# EAGLE design supply5v (EAGLE 7.7.0)
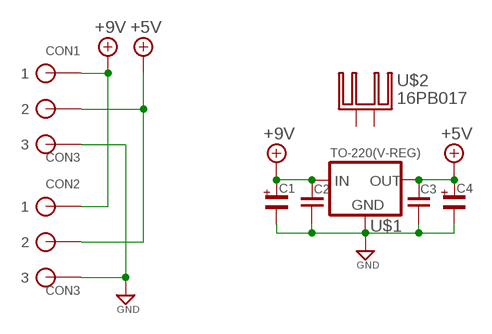
[diagram p0: schematic, sheet 1]

## Parts
C1  コンデンサ(電解)E2.5-5  [D=1,φ=5]
C2  (コンデンサ)セラミック050-024X044  [C050-024X044]
C3  (コンデンサ)セラミック050-024X044  [C050-024X044]
C4  コンデンサ(電解)E2.5-5  [D=1,φ=5]
CON1  CON3  [CON3]
CON2  CON3  [CON3]
U$1  TO-220(V-REG)  [TO-220]
U$2  16PB017  [16PB017]

## Nets
+5V: C3.1 C4.+ CON1.P$2 CON2.P$2 U$1.3(OUT)
+9V: C1.+ C2.1 CON1.P$1 CON2.P$1 U$1.2(IN)
GND: C1.- C2.2 C3.2 C4.- CON1.P$3 CON2.P$3 U$1.1(GND)
Unconnected: U$2.P$1(K) U$2.P$2(K)

## Library data of the parts
C1 C4 = (Foundation)電解コンデンサ:コンデンサ(電解): POLARIZED CAPACITOR, European symbol
C2 C3 = (Foundation)セラミックコンデンサ:(コンデンサ)セラミック: CAPACITOR, European symbol
CON1 CON2 = (コネクタ)XH:CON3: low insertion CON
U$1 = (半導体)FET＆トランジスタ:TO-220(V-REG)
U$2 = _Heatsink(ﾋｰﾄｼﾝｸ秋月):16PB017

## Board
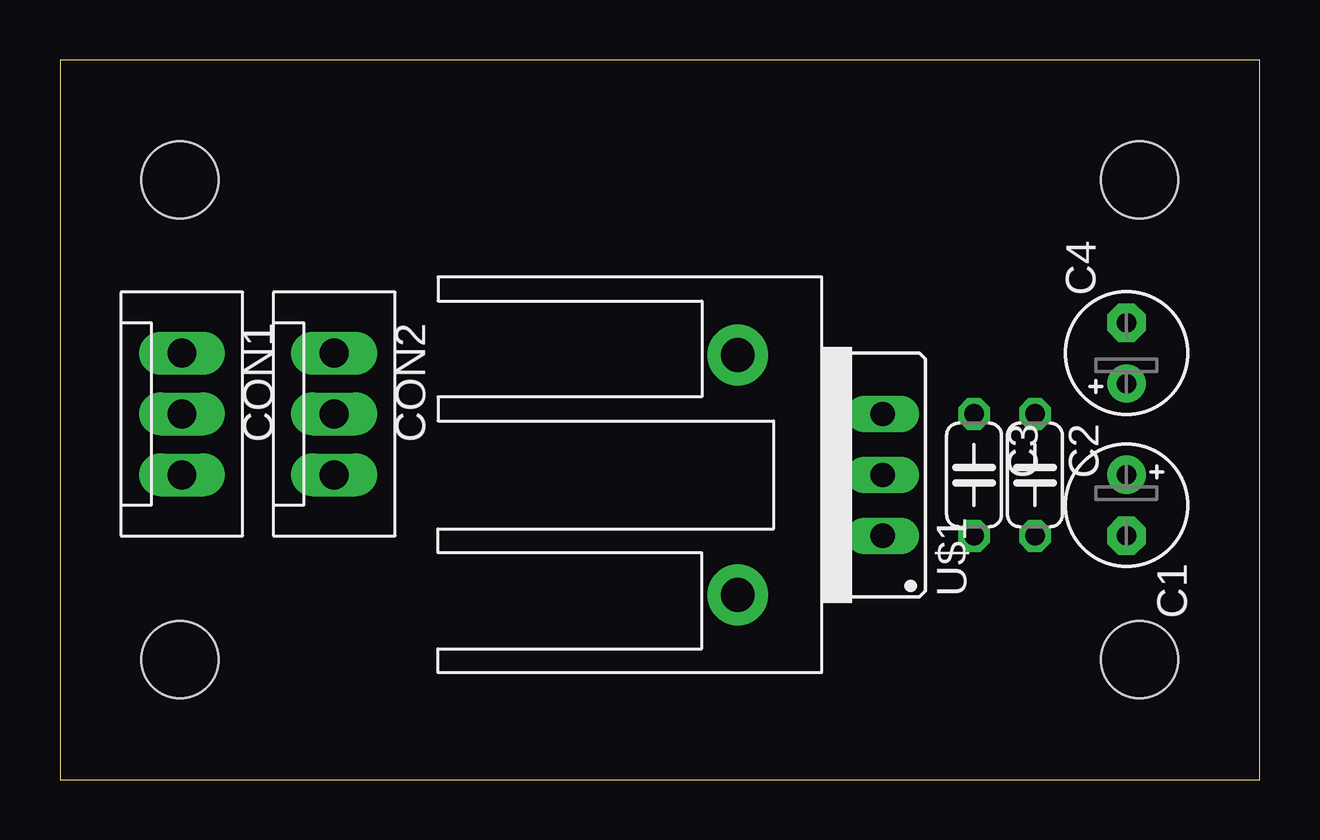
[diagram p1: board, top side]
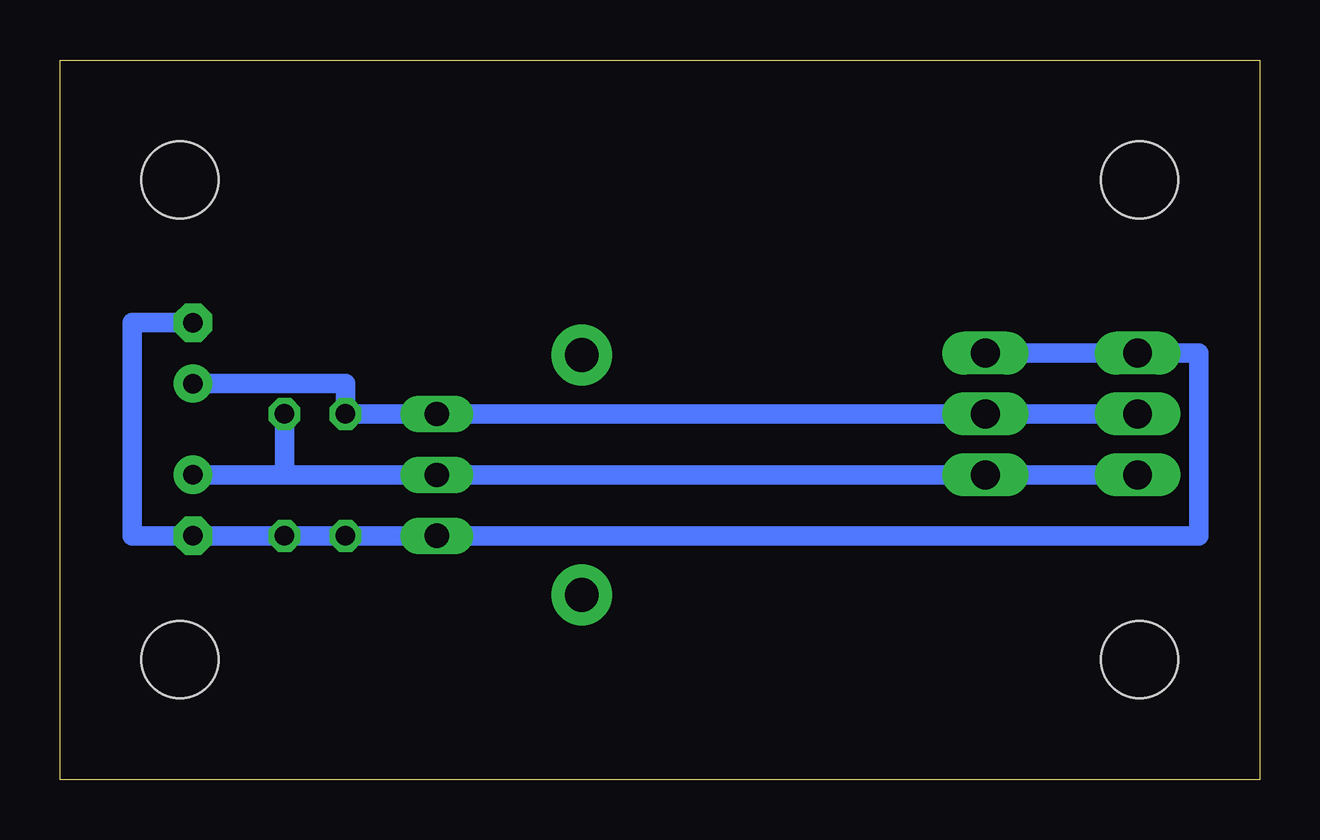
[diagram p2: board, bottom side, seen from below]

Size 50 x 30 mm. Coordinates in mm from the lower left corner, seen from the top.
Outline: 0,0 50,0 50,30 0,30 0,0
Copper layers (1*16): Top 0.035mm / dielectric 1.5mm / Bottom 0.035mm
Design rules "default": minimum track width 10mil, minimum drill 24mil, track to track 8mil, track to pad 8mil, pad to pad 8mil, via to via 8mil, smd to smd 8mil, copper to edge 40mil, drill to drill 8mil, minimum pad ring 10mil, minimum via ring 8mil, stop-mask expansion 4mil, vias tented up to drill 0mil, thermal gap 10mil
Holes 3.2 mm at 5,5 5,25 45,25 45,5

### Footprints (pad centres in the part's own frame; a part is rotated, then mirrored left to right if it is on the bottom)
D=1,φ=5 = drill 0.813 pad 1.6: + -1.27,0 | drill 0.813 pad 1.6 octagon: - 1.27,0
C050-024X044 = drill 0.813 octagon: 1 -2.54,0; 2 2.54,0
CON3 = drill 1.2 long: P$1 2.54,0; P$2 0,0; P$3 -2.54,0
TO-220 = drill 1.016 long: 1 -2.54,0; 2 0,0; 3 2.54,0
16PB017 = drill 1.4 pad 2.54: P$1 -5,3.5; P$2 5,3.5

### Placement (x,y rotation side)
C1  44.45,11.43 270 top
C2  40.64,12.7 270 top
C3  38.1,12.7 270 top
C4  44.45,17.78 90 top
CON1  5.08,15.24 270 top
CON2  11.43,15.24 270 top
U$1  34.29,12.7 90 top
U$2  31.75,12.7 90 top

### Tracks (layer width: path | path; a pad name or v marks a point on that pad's centre or on a via)
+5V
  Bottom 0.813: CON1.P$2 CON2.P$2 U$1.3 C3.1 38.1,16.51 C4.+
+9V
  Bottom 0.813: CON1.P$1 CON2.P$1 U$1.2 40.64,12.7 | 40.64,12.7 C2.1 | C1.+ 40.64,12.7
GND
  Bottom 0.813: CON2.P$3 CON1.P$3 2.54,17.78 2.54,10.16 U$1.1 C3.2 C2.2 C1.- 46.99,10.16 46.99,19.05 C4.-